# Altium project Ejemplo4.PrjPcb
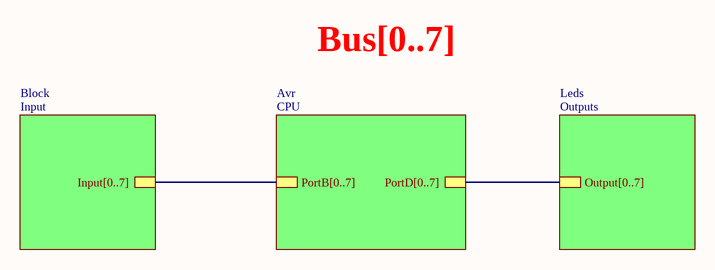
[diagram p0: main.SchDoc]
4 sheets, 18 parts. Net scope: hierarchical (ports join the sheet entries above them; power ports are global).
Board file: PCB3.PcbDoc
Sheets:
  main.SchDoc
    Leds = Outputs.SchDoc
    Avr = CPU.SchDoc
    Block = Input.SchDoc

## Sheet main.SchDoc
size A4; SheetNumber: 1; SheetTotal: 2

### Sub-sheets
Avr = CPU: PortB[0..7], PortD[0..7]
Block = Input: Input[0..7]
Leds = Outputs: Output[0..7]

### Buses and harness runs
bus sheet Avr/PortB[0..7] = sheet Block/Input[0..7]
bus sheet Avr/PortD[0..7] = sheet Leds/Output[0..7]

### Notes on the sheet
- Bus[0..7]

## Sheet Outputs.SchDoc
size A4; SheetNumber: 4; SheetTotal: 4
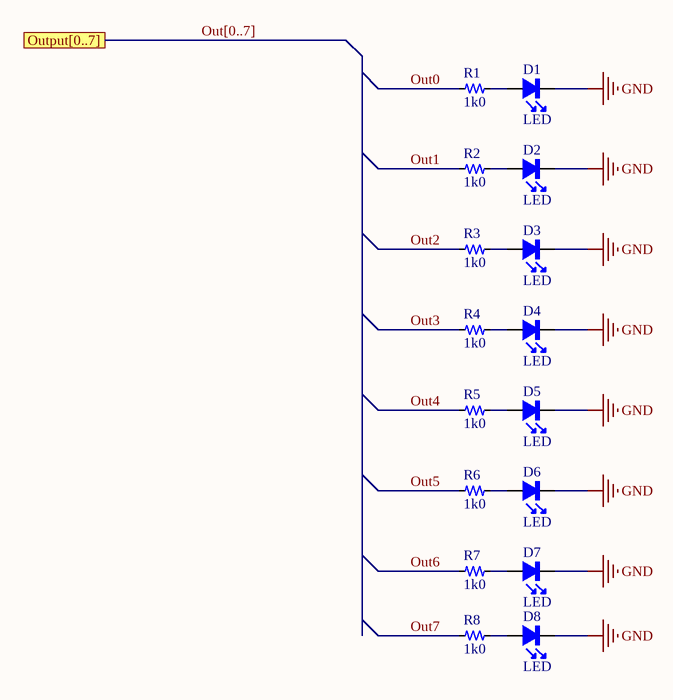
[diagram p1: Outputs.SchDoc]

### Parts
D1  LED  [LED-0805]
D2  LED  [LED-0805]
D3  LED  [LED-0805]
D4  LED  [LED-0805]
D5  LED  [LED-0805]
D6  LED  [LED-0805]
D7  LED  [LED-0805]
D8  LED  [LED-0805]
R1  1k0  [R0805]
R2  1k0  [R0805]
R3  1k0  [R0805]
R4  1k0  [R0805]
R5  1k0  [R0805]
R6  1k0  [R0805]
R7  1k0  [R0805]
R8  1k0  [R0805]

### Ports
Output[0..7]

### Nets
GND: D1.1 D2.1 D3.1 D4.1 D5.1 D6.1 D7.1 D8.1
Out0: R1.2
Out1: R2.2
Out2: R3.2
Out3: R4.2
Out4: R5.2
Out5: R6.2
Out6: R7.2
Out7: R8.2
NetD1_2: D1.2 R1.1
NetD2_2: D2.2 R2.1
NetD3_2: D3.2 R3.1
NetD4_2: D4.2 R4.1
NetD5_2: D5.2 R5.1
NetD6_2: D6.2 R6.1
NetD7_2: D7.2 R7.1
NetD8_2: D8.2 R8.1

### Buses and harness runs
bus Out[0..7] = port Output[0..7]

### Library data of the parts
D1-D8 = LED: LED - Light-Emitting Diode; Manufacturer: *; Part number: *; Unit price: *; Value: LED
R1-R8 = Resistor: Single resistor; Power: 0.125W; Manufacturer: *; Part number: *; Value: 1k0; Unit price: 0.1

## Sheet CPU.SchDoc
size A4; SheetNumber: 3; SheetTotal: 4
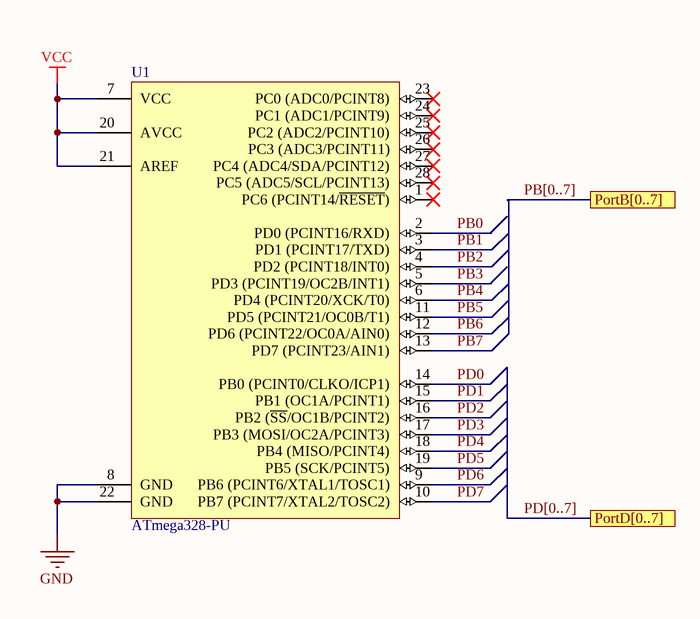
[diagram p2: CPU.SchDoc]

### Parts
U1  ATmega328-PU  [28P3]

### Ports
PortB[0..7], PortD[0..7]

### Nets
GND: U1.8(GND) U1.22(GND)
VCC: U1.7(VCC) U1.20(AVCC) U1.21(AREF)
PB0: U1.2(PD0_(PCINT16/RXD))  [project net In0]
PB1: U1.3(PD1_(PCINT17/TXD))  [project net In1]
PB2: U1.4(PD2_(PCINT18/INT0))  [project net In2]
PB3: U1.5(PD3_(PCINT19/OC2B/INT1))  [project net In3]
PB4: U1.6(PD4_(PCINT20/XCK/T0))  [project net In4]
PB5: U1.11(PD5_(PCINT21/OC0B/T1))  [project net In5]
PB6: U1.12(PD6_(PCINT22/OC0A/AIN0))  [project net In6]
PB7: U1.13(PD7_(PCINT23/AIN1))  [project net In7]
PD0: U1.14(PB0_(PCINT0/CLKO/ICP1))  [project net Out0]
PD1: U1.15(PB1_(OC1A/PCINT1))  [project net Out1]
PD2: U1.16(PB2_(~{SS}/OC1B/PCINT2))  [project net Out2]
PD3: U1.17(PB3_(MOSI/OC2A/PCINT3))  [project net Out3]
PD4: U1.18(PB4_(MISO/PCINT4))  [project net Out4]
PD5: U1.19(PB5_(SCK/PCINT5))  [project net Out5]
PD6: U1.9(PB6_(PCINT6/XTAL1/TOSC1))  [project net Out6]
PD7: U1.10(PB7_(PCINT7/XTAL2/TOSC2))  [project net Out7]

Not connected (* = marked no-connect by the designer): U1 1(PC6_(PCINT14/~{RESET}))* 23(PC0_(ADC0/PCINT8))* 24(PC1_(ADC1/PCINT9))* 25(PC2_(ADC2/PCINT10))* 26(PC3_(ADC3/PCINT11))* 27(PC4_(ADC4/SDA/PCINT12))* 28(PC5_(ADC5/SCL/PCINT13))*

### Buses and harness runs
bus PB[0..7] = port PortB[0..7]
bus PD[0..7] = port PortD[0..7]

### Library data of the parts
U1 = CMP-0095-00015-2: 8-bit AVR Microcontroller, 32KB Flash, 1KB EEPROM, 2KB SRAM, 28-pin PDIP, Industrial Grade (-40°C to 85°C); ComponentLink3Description: ATmega48A/48PA/88A/88PA/168A/168PA/328/328P Summary; RevisionNote: DatasheetVersion updated. URLs added.; DatasheetVersion: revD, May-2011; ComponentLink1URL: http://www.atmel.com/; PackageVersion: revB, Sep-2001; PackageDescription: 28-lead (0.300"/7.62mm Wide) Plastic Dual Inline Package (PDIP); PackageReference: 28P3; ComponentLink1Description: Manufacturer URL; ComponentLink2Description: ATmega48A/48PA/88A/88PA/168A/168PA/328/328P Datasheet; ComponentLink3URL: http://www.atmel.com/dyn/resources/prod_documents/8271S.pdf; ComponentLink2URL: http://www.atmel.com/dyn/resources/prod_documents/8271.pdf

## Sheet Input.SchDoc
size A4; SheetNumber: 2; SheetTotal: 4
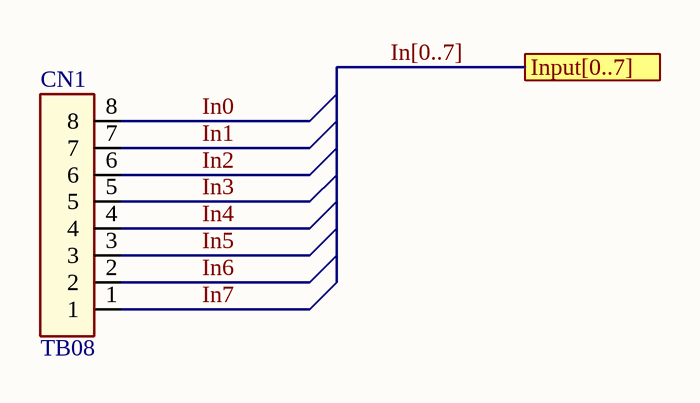
[diagram p3: Input.SchDoc]

### Parts
CN1  TB08  [TB508-08]

### Ports
Input[0..7]

### Nets
In0: CN1.8
In1: CN1.7
In2: CN1.6
In3: CN1.5
In4: CN1.4
In5: CN1.3
In6: CN1.2
In7: CN1.1

### Buses and harness runs
bus In[0..7] = port Input[0..7]

### Library data of the parts
CN1 = TB-08: Terminal Block; Manufacturer: *; Part number: *; Value: TB08; Unit price: *

## Nets that join several sheets
GND: Outputs (8 pins), CPU (U1.8 U1.22)
In0: CPU (U1.2), Input (CN1.8)
In1: CPU (U1.3), Input (CN1.7)
In2: CPU (U1.4), Input (CN1.6)
In3: CPU (U1.5), Input (CN1.5)
In4: CPU (U1.6), Input (CN1.4)
In5: CPU (U1.11), Input (CN1.3)
In6: CPU (U1.12), Input (CN1.2)
In7: CPU (U1.13), Input (CN1.1)
Out0: Outputs (R1.2), CPU (U1.14)
Out1: Outputs (R2.2), CPU (U1.15)
Out2: Outputs (R3.2), CPU (U1.16)
Out3: Outputs (R4.2), CPU (U1.17)
Out4: Outputs (R5.2), CPU (U1.18)
Out5: Outputs (R6.2), CPU (U1.19)
Out6: Outputs (R7.2), CPU (U1.9)
Out7: Outputs (R8.2), CPU (U1.10)